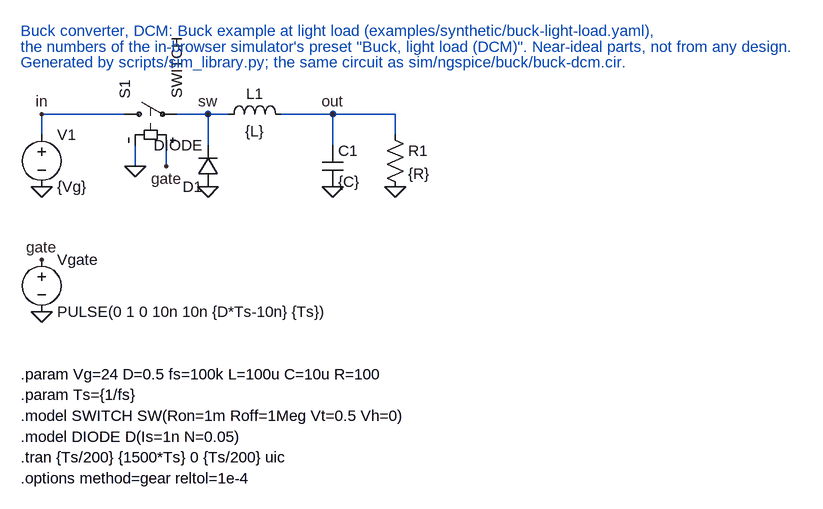
[diagram p0: schematic buck-dcm.asc]
buck-dcm.asc, the LTspice schematic file:
Version 4
SHEET 1 704 848
WIRE 0 64 0 96
WIRE 192 112 192 144
WIRE 144 112 144 144
WIRE 0 64 128 64
WIRE 208 64 256 64
WIRE 256 64 256 112
WIRE 256 64 288 64
WIRE 368 64 448 64
WIRE 448 64 448 112
WIRE 448 64 544 64
WIRE 544 64 544 96
FLAG 0 64 in
FLAG 0 176 0
FLAG 0 288 gate
FLAG 0 368 0
FLAG 192 144 gate
FLAG 144 144 0
FLAG 256 176 0
FLAG 256 64 sw
FLAG 448 176 0
FLAG 544 176 0
FLAG 448 64 out
SYMBOL voltage 0 80 R0
SYMATTR InstName V1
SYMATTR Value {Vg}
SYMBOL voltage 0 272 R0
SYMATTR InstName Vgate
SYMATTR Value PULSE(0 1 0 10n 10n {D*Ts-10n} {Ts})
SYMBOL sw 112 64 R270
SYMATTR InstName S1
SYMATTR Value SWITCH
SYMBOL diode 272 176 R180
SYMATTR InstName D1
SYMATTR Value DIODE
SYMBOL ind 272 80 R270
WINDOW 0 32 56 VTop 2
WINDOW 3 5 56 VBottom 2
SYMATTR InstName L1
SYMATTR Value {L}
SYMBOL cap 432 112 R0
SYMATTR InstName C1
SYMATTR Value {C}
SYMBOL res 528 80 R0
SYMATTR InstName R1
SYMATTR Value {R}
TEXT -32 -64 Left 2 ;Buck converter, DCM: Buck example at light load (examples/synthetic/buck-light-load.yaml),
TEXT -32 -40 Left 2 ;the numbers of the in-browser simulator's preset "Buck, light load (DCM)". Near-ideal parts, not from any design.
TEXT -32 -16 Left 2 ;Generated by scripts/sim_library.py; the same circuit as sim/ngspice/buck/buck-dcm.cir.
TEXT -32 464 Left 2 !.param Vg=24 D=0.5 fs=100k L=100u C=10u R=100
TEXT -32 496 Left 2 !.param Ts={1/fs}
TEXT -32 528 Left 2 !.model SWITCH SW(Ron=1m Roff=1Meg Vt=0.5 Vh=0)
TEXT -32 560 Left 2 !.model DIODE D(Is=1n N=0.05)
TEXT -32 592 Left 2 !.tran {Ts/200} {1500*Ts} 0 {Ts/200} uic
TEXT -32 624 Left 2 !.options method=gear reltol=1e-4

The netlist it stands for:
* buck-dcm.asc
V1 in 0 {Vg}
Vgate gate 0 PULSE(0 1 0 10n 10n {D*Ts-10n} {Ts})
S1 in sw gate 0 SWITCH
D1 0 sw DIODE
L1 sw out {L}
C1 out 0 {C}
R1 out 0 {R}
.model D D
.lib standard.dio
* Buck converter, DCM: Buck example at light load (examples/synthetic/buck-light-load.yaml),
* the numbers of the in-browser simulator's preset "Buck, light load (DCM)". Near-ideal parts, not from any design.
* Generated by scripts/sim_library.py; the same circuit as sim/ngspice/buck/buck-dcm.cir.
.param Vg=24 D=0.5 fs=100k L=100u C=10u R=100
.param Ts={1/fs}
.model SWITCH SW(Ron=1m Roff=1Meg Vt=0.5 Vh=0)
.model DIODE D(Is=1n N=0.05)
.tran {Ts/200} {1500*Ts} 0 {Ts/200} uic
.options method=gear reltol=1e-4
.backanno
.end